# Altium schematic sheet STM32F412CGU6_ESP32-C3_board.SchDoc
size A4; SheetNumber: 1; SheetTotal: 1
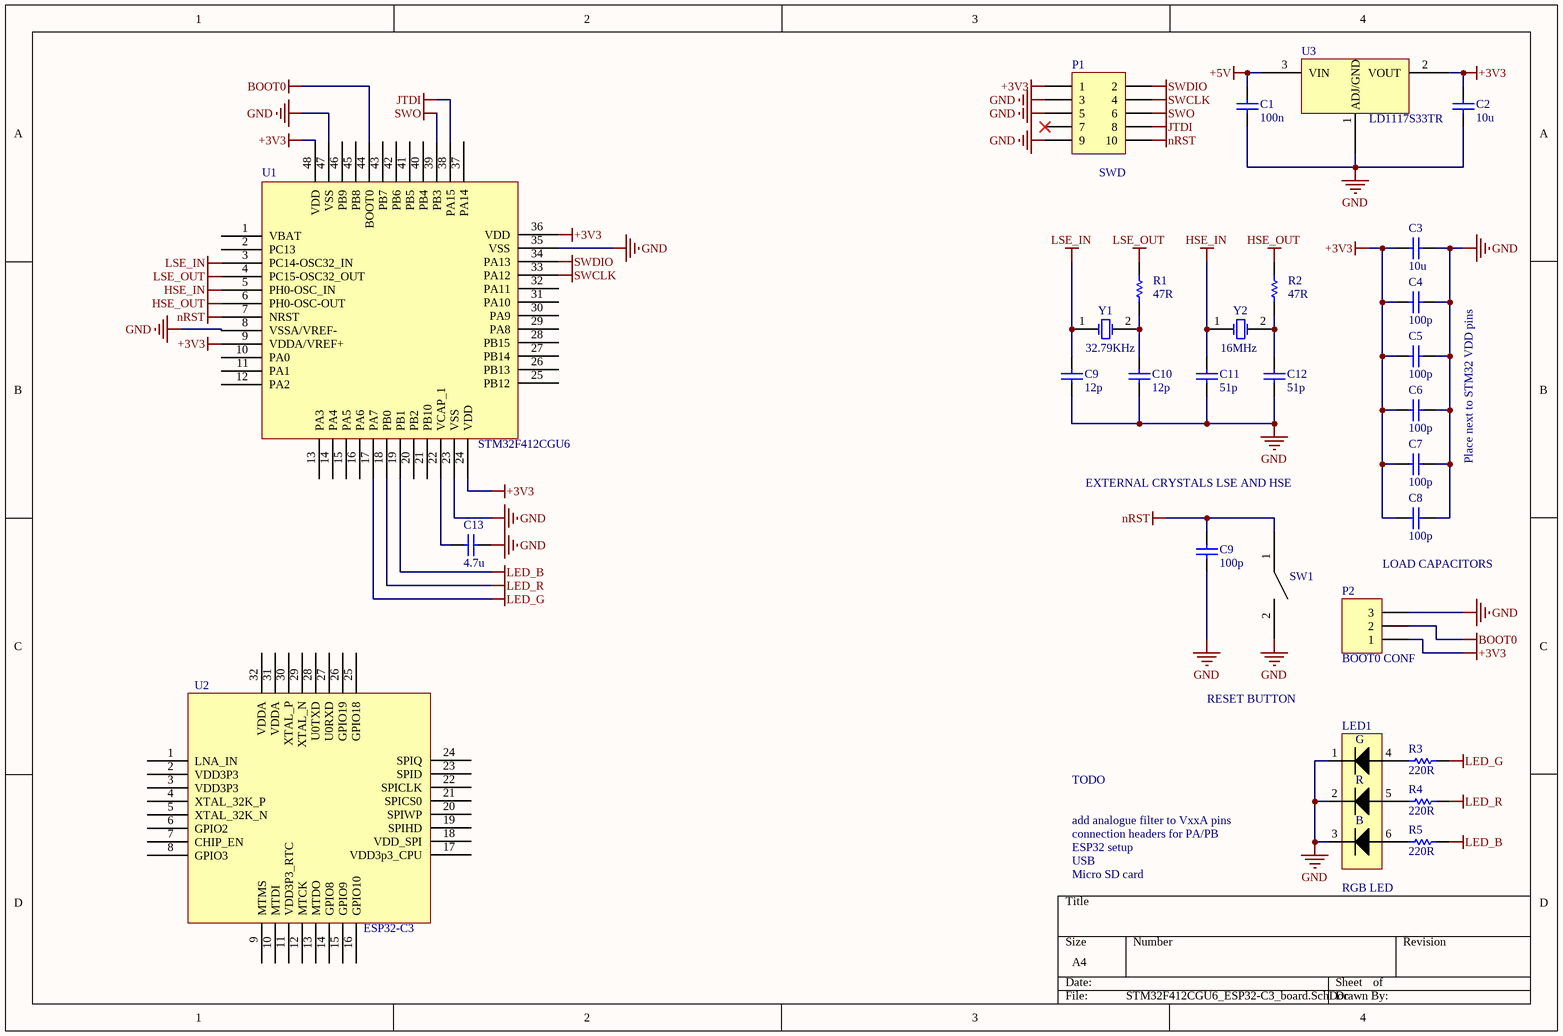
[diagram p0: STM32F412CGU6_ESP32-C3_board.SchDoc]

## Parts
(Parts that share a designator on the sheet are numbered #1, #2 ... from top to bottom, then left to right.)
C1  value 100n  [0805-CHIP]  (hidden comment: Cap)
C2  value 10u  [0805-CHIP]  (hidden comment: Cap)
C3  value 10u  [0805-CHIP]  (hidden comment: Cap)
C4  value 100p  [0805-CHIP]  (hidden comment: Cap)
C5  value 100p  [0805-CHIP]  (hidden comment: Cap)
C6  value 100p  [0805-CHIP]  (hidden comment: Cap)
C7  value 100p  [0805-CHIP]  (hidden comment: Cap)
C8  value 100p  [0805-CHIP]  (hidden comment: Cap)
C9#1  value 12p  [0805-CHIP]  (hidden comment: Cap)
C9#2  value 100p  [0805-CHIP]  (hidden comment: Cap)
C10  value 12p  [0805-CHIP]  (hidden comment: Cap)
C11  value 51p  [0805-CHIP]  (hidden comment: Cap)
C12  value 51p  [0805-CHIP]  (hidden comment: Cap)
C13  value 4.7u  [0805-CHIP]  (hidden comment: Cap)
LED1  RGB LED  [RGB-LED]
P1  SWD  [HDR2X5]
P2  BOOT0 CONF  [HDR1X3]
R1  value 47R  [0805-CHIP]  (hidden comment: Res1)
R2  value 47R  [0805-CHIP]  (hidden comment: Res1)
R3  value 220R  [0805-CHIP]  (hidden comment: Res1)
R4  value 220R  [0805-CHIP]  (hidden comment: Res1)
R5  value 220R  [0805-CHIP]  (hidden comment: Res1)
SW1  SWITCH  [PUSHBUTTON-SP0600]  (value not drawn)
U1  STM32F412CGU6  [STM32F412CGU6]  (value not drawn)
U2  ESP32-C3  [ESP32-C3]  (value not drawn)
U3  LD1117S33TR  [SOT-223-CHIP]  (value not drawn)
Y1  32.79KHz  [HC-49U]
Y2  16MHz  [HC-49U]

## Nets
+3V3: C2.2 C3.2 C4.2 C5.2 C6.2 C7.2 C8.2 P1.1 P2.1 U1.9(VDDA/VREF+) U1.24(VDD) U1.36(VDD) U1.48(VDD) U3.2(VOUT)
+5V: C1.2 U3.3(VIN)
BOOT0: P2.2 U1.44(BOOT0)
GND: C1.1 C2.1 C3.1 C4.1 C5.1 C6.1 C7.1 C8.1 C9#1.2 C9#2.2 C10.2 C11.2 C12.2 C13.1 LED1.1 LED1.2(R) LED1.3 P1.3 P1.5 P1.9 P2.3 SW1.2 U1.8(VSSA/VREF-) U1.23(VSS) U1.35(VSS) U1.47(VSS) U3.1(ADJ/GND)
HSE_IN: C11.1 U1.5(PH0-OSC_IN) Y2.1(OSC1)
HSE_OUT: R2.2 U1.6(PH0-OSC-OUT)
JTDI: P1.8 U1.38(PA15)
LED_B: R5.1 U1.19(PB1)
LED_G: R3.1 U1.17(PA7)
LED_R: R4.1 U1.18(PB0)
LSE_IN: C9#1.1 U1.3(PC14-OSC32_IN) Y1.1(OSC1)
LSE_OUT: R1.2 U1.4(PC15-OSC32_OUT)
nRST: C9#2.1 P1.10 SW1.1 U1.7(NRST)
SWCLK: P1.4 U1.33(PA12)
SWDIO: P1.2 U1.34(PA13)
SWO: P1.6 U1.39(PB3)
NetC10_1: C10.1 R1.1 Y1.2(OSC2)
NetC12_1: C12.1 R2.1 Y2.2(OSC2)
NetC13_2: C13.2 U1.22(VCAP_1)
NetLED1_4: LED1.4 R3.2
NetLED1_5: LED1.5 R4.2
NetLED1_6: LED1.6 R5.2

Not connected (* = marked no-connect by the designer): P1 7*; U1 1(VBAT) 2(PC13) 10(PA0) 11(PA1) 12(PA2) 13(PA3) 14(PA4) 15(PA5) 16(PA6) 20(PB2) 21(PB10) 25(PB12) 26(PB13) 27(PB14) 28(PB15) 29(PA8) 30(PA9) 31(PA10) 32(PA11) 37(PA14) 40(PB4) 41(PB5) 42(PB6) 43(PB7) 45(PB8) 46(PB9); U2 1(LNA_IN) 2(VDD3P3) 3(VDD3P3) 4(XTAL_32K_P) 5(XTAL_32K_N) 6(GPIO2) 7(CHIP_EN) 8(GPIO3) 9(MTMS) 10(MTDI) 11(VDD3P3_RTC) 12(MTCK) 13(MTDO) 14(GPIO8) 15(GPIO9) 16(GPIO10) 17(VDD3p3_CPU) 18(VDD_SPI) 19(SPIHD) 20(SPIWP) 21(SPICS0) 22(SPICLK) 23(SPID) 24(SPIQ) 25(GPIO18) 26(GPIO19) 27(U0RXD) 28(U0TXD) 29(XTAL_N) 30(XTAL_P) 31(VDDA) 32(VDDA)

## Notes on the sheet
- EXTERNAL CRYSTALS LSE AND HSE
- Place next to STM32 VDD pins
- LOAD CAPACITORS
- RESET BUTTON
- TODO
- add analogue filter to VxxA pins
- connection headers for PA/PB
- ESP32 setup
- USB
- Micro SD card
- (in symbol RGB-LED) G; B

## Library data of the parts
C1-C8 C9#1 C9#2 C10-C13 = Cap: Capacitor; Published: 8-Jun-2000; LatestRevisionDate: 17-Jul-2002; LatestRevisionNote: Re-released for DXP Platform.; PackageReference: RAD-0.3; Publisher: Altium Limited; PackageDescription: Radial Cap, Thru-Hole; 2 Leads; 0.3 in Pin Spacing
LED1 = RGB-LED
P1 = Header 5X2: Header, 5-Pin, Dual row; LatestRevisionDate: 17-Jul-2002; LatestRevisionNote: Re-released for DXP Platform.; Publisher: Altium Limited
P2 = Header 3: Header, 3-Pin; LatestRevisionDate: 17-Jul-2002; LatestRevisionNote: Re-released for DXP Platform.; Publisher: Altium Limited
R1-R5 = Res1: Resistor; Published: 8-Jun-2000; LatestRevisionDate: 17-Jul-2002; LatestRevisionNote: Re-released for DXP Platform.; PackageReference: AXIAL-0.3; Publisher: Altium Limited; PackageDescription: Axial Device, Thru-Hole; 2 Leads; 0.3 in Pin Spacing
Y1 Y2 = XTAL: Crystal Oscillator; Published: 8-Jun-2000; LatestRevisionDate: 17-Jul-2002; LatestRevisionNote: Re-released for DXP Platform.; PackageReference: R38; Publisher: Altium Limited; PackageDescription: Crystal, Thru-Hole; 2 Leads; Body 3.1 x 8.2 mm (Dia.xH)